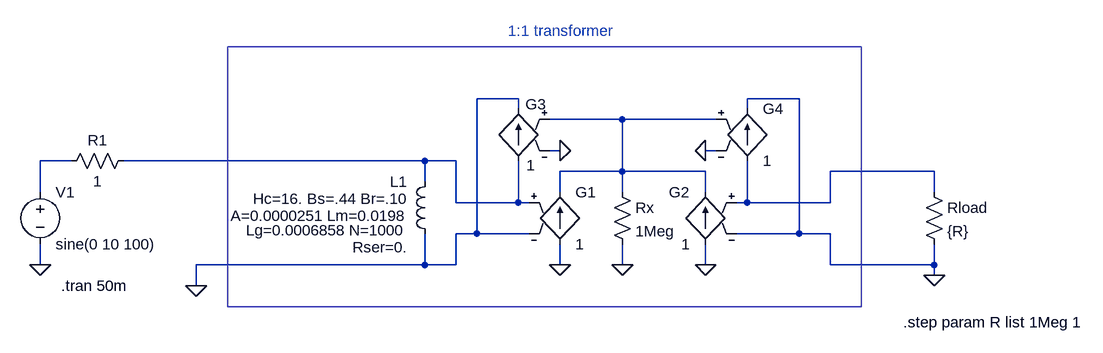
[diagram p0: schematic Xformer.asc]
Xformer.asc, the LTspice schematic file:
Version 4
SHEET 1 1608 680
WIRE 560 192 560 240
WIRE -32 80 16 80
WIRE -32 240 -32 208
WIRE -32 128 -32 80
WIRE 96 80 560 80
WIRE 768 240 768 208
WIRE 768 128 768 96
WIRE 768 96 864 96
WIRE 864 96 864 128
WIRE 864 208 864 240
WIRE 992 240 992 208
WIRE 992 128 992 96
WIRE 992 96 864 96
WIRE 752 16 864 16
WIRE 864 16 864 96
WIRE 864 16 1008 16
WIRE 720 144 704 144
WIRE 608 192 640 192
WIRE 704 80 704 144
WIRE 704 0 704 -16
WIRE 704 -16 640 -16
WIRE 640 -16 640 192
WIRE 704 144 608 144
WIRE 640 192 720 192
WIRE 752 64 768 64
WIRE 992 64 1008 64
WIRE 1056 80 1056 144
WIRE 1056 144 1040 144
WIRE 1040 192 1136 192
WIRE 1056 -16 1056 0
WIRE 560 80 608 80
WIRE 560 80 560 112
WIRE 608 80 608 144
WIRE 608 192 608 240
WIRE 608 240 560 240
WIRE 1184 192 1184 240
WIRE 1136 -16 1136 192
WIRE 1136 192 1184 192
WIRE 1136 -16 1056 -16
WIRE 1344 96 1344 128
WIRE 1344 208 1344 240
WIRE 1056 144 1184 144
WIRE 1184 144 1184 96
WIRE 1184 96 1344 96
WIRE 1184 240 1344 240
WIRE 1344 240 1344 256
WIRE 560 240 208 240
WIRE 208 240 208 272
FLAG 208 272 0
FLAG -32 240 0
FLAG 768 64 0
FLAG 864 240 0
FLAG 768 240 0
FLAG 992 240 0
FLAG 992 64 0
FLAG 1344 256 0
SYMBOL ind 576 96 M0
WINDOW 123 41 68 Left 0
WINDOW 39 43 91 Left 0
WINDOW 40 42 117 Left 0
WINDOW 0 43 16 Left 0
WINDOW 3 42 42 Left 0
SYMATTR Value2 A=0.0000251 Lm=0.0198
SYMATTR SpiceLine Lg=0.0006858 N=1000
SYMATTR SpiceLine2 Rser=0.
SYMATTR InstName L1
SYMATTR Value Hc=16. Bs=.44 Br=.10
SYMBOL voltage -32 112 R0
SYMATTR InstName V1
SYMATTR Value sine(0 10 100)
SYMBOL res 112 64 R90
WINDOW 0 0 56 VBottom 0
WINDOW 3 32 56 VTop 0
SYMATTR InstName R1
SYMATTR Value 1
SYMBOL g 768 112 R0
SYMATTR InstName G1
SYMATTR Value 1
SYMBOL g 992 112 M0
SYMATTR InstName G2
SYMATTR Value 1
SYMBOL g 704 -16 M0
WINDOW 0 -11 9 Right 0
WINDOW 3 -12 103 Right 0
SYMATTR InstName G3
SYMATTR Value 1
SYMBOL g 1056 -16 R0
SYMATTR InstName G4
SYMATTR Value 1
SYMBOL res 848 112 R0
SYMATTR InstName Rx
SYMATTR Value 1Meg
SYMBOL res 1328 112 R0
SYMATTR InstName Rload
SYMATTR Value {R}
TEXT 0 272 Left 0 !.tran 50m
TEXT 1296 328 Left 0 !.step param R list 1Meg 1
TEXT 688 -120 Left 0 ;1:1 transformer
LINE Normal 1232 -96 256 -96
LINE Normal 1232 304 1232 -96
LINE Normal 256 304 1232 304
LINE Normal 256 -96 256 304

The netlist it stands for:
* Xformer.asc
L1 N002 0 Hc=16. Bs=.44 Br=.10 A=0.0000251 Lm=0.0198 Lg=0.0006858 N=1000 Rser=0.
V1 N001 0 sine(0 10 100)
R1 N002 N001 1
G1 0 N003 N002 0 1
G2 0 N003 N004 0 1
G3 N002 0 N003 0 1
G4 N004 0 N003 0 1
Rx N003 0 1Meg
Rload N004 0 {R}
.tran 50m
.step param R list 1Meg 1
* 1:1 transformer
.backanno
.end